# Altium schematic sheet Power.SchDoc
size A
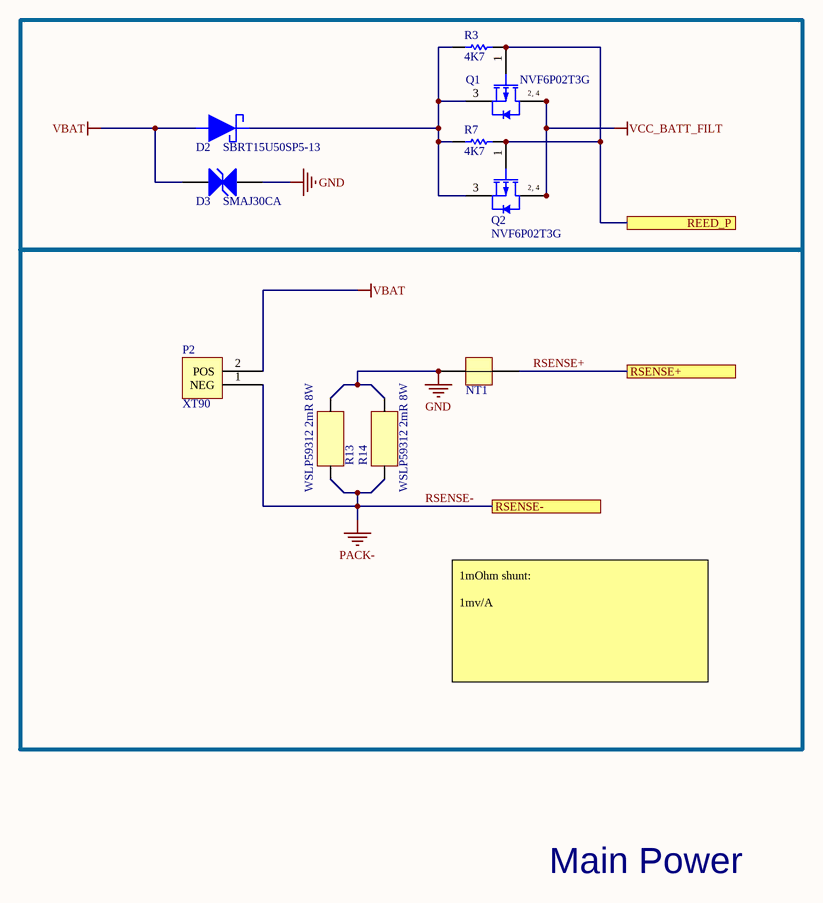
[diagram p0: Power.SchDoc]

## Parts
D2  SBRT15U50SP5-13  [SBRT15U50SP5-13]
D3  SMAJ30CA  [LFUS-DO-214AC-A-2_V]
NT1  Net Tie  [Net_Tie_80mil]  (value not drawn)  (net tie, no BOM)
P2  XT90  [XT90]
Q1  NVF6P02T3G  [ONSC-SOT-223-4-318E-04_V]
Q2  NVF6P02T3G  [ONSC-SOT-223-4-318E-04_V]
R3  4K7  [RESC0603(1608)_L]
R7  4K7  [RESC0603(1608)_L]
R13  WSLP59312 2mR 8W  [WSLP59312L000FEA]
R14  WSLP59312 2mR 8W  [WSLP59312L000FEA]

## Ports
REED_P, RSENSE+, RSENSE-

## Nets
GND: D3.2(A) NT1.1 R13.2 R14.2
RSENSE-: P2.1(NEG) R13.1 R14.1 ; port RSENSE-  [also labelled PACK-]
VBAT: D2.1 D3.1(A) P2.2(POS)
VCC_BATT_FILT: Q1.2(D) Q1.4(D) Q2.2(D) Q2.4(D)
REED_P: Q1.1(G) Q2.1(G) R3.1 R7.1 ; port REED_P
RSENSE+: NT1.2 ; port RSENSE+
NetD2_2: D2.2 Q1.3(S) Q2.3(S) R3.2 R7.2

## Notes on the sheet
- 1mOhm shunt:
  1mv/A
- Main Power
- (in symbol CMP-1058-00713-1) 2, 4

## Library data of the parts
D2 = SBRT15U50SP5-13: Manufacturer: Diodes Incorporated; Diode Type: Super Barrier; Current - Average Rectified (Io): 15A; Speed: Fast Recovery =< 500ns, > 200mA (Io); Supplier 1: Digi-Key; Supplier Part Number 1: SBRT15U50SP5-13DICT-ND; Manufacturer Part Number: SBRT15U50SP5-13; RoHS: RoHS Compliant; Category: Discrete Semiconductor Products; Stock 1: 12134; Pricing 1: 1=0.93, 10=0.823, 100=0.6306, 500=0.49852, 1000=0.39882 (USD); Packaging: Cut Tape (CT); Part Status: Active; Capacitance @ Vr, F: -; Mounting Type: Surface Mount; Package / Case: PowerDI™ 5; Supplier Device Package: PowerDI®5; Operating Temperature - Junction: -65°C ~ 150°C; ComponentLink1URL: https://media.digikey.com/pdf/Data%20Sheets/Diodes%20PDFs/SBRT15U50SP5.pdf; ComponentLink1Description: https://media.digikey.com/pdf/Data%20Sheets/Diodes%20PDFs/SBRT15U50SP5.pdf
D3 = CMP-2000-07088-1: Transient Voltage Suppression Diode, 30 V, -65 to 150 degC, 2-Pin SMD, RoHS, Tape and Reel; Manufacturer: Littelfuse-Inc.; Current - Peak Pulse (10/1000µs): 8.3A; Power - Peak Pulse: 400W; Voltage - Breakdown (Min): 33.3V; Bidirectional Channels: 1; Power Line Protection: No; Voltage - Clamping (Max) @ Ipp: 48.4V; Voltage - Reverse Standoff (Typ): 30V; Type: Zener; Category: CircuitProtection; Datasheet Version: 11/2015; Package Description: 2-Pin Surface Mount Device, Body 4.295 x 2.595 mm; Family: TVS-Diodes; Manufacturer URL: http://www.littelfuse.com/; Series: SMAJ; Package / Case: DO-214AC,SMA; Capacitance @ Frequency: -; Package Reference: DO-214AC; Packaging: Digi-Reel®; Applications: GeneralPurpose; Mounting Technology: SurfaceMount; Mounting Type: SurfaceMount; Unidirectional Channels: -; Supplier Device Package: DO-214AC(SMA); Operating Temperature: -55°C~150°C(TJ); Datasheet URL: http://www.littelfuse.com/~/media/electronics/datasheets/tvs_diodes/littelfuse_tvs_diode_smaj_datasheet.pdf.pdf
NT1 = Net Tie: Use to tie together nets
Q1 Q2 = CMP-1058-00713-1: Power MOSFET, -10 A, -20 V, P-Channel, 4-Pin SOT-223, Pb-Free, Tape and Reel; Manufacturer: On Semiconductor; VGS Max (V): 8; VGS(th) Max (V): 1; Channel Polarity: P Channel; V(BR)DSS Min (V): 20; Configuration: Single; Qrr Typ (nC): 36; PD Max (W): 8.3; Package Type: SOT-223-4 / TO-261-4; ComponentLink3URL: http://www.onsemi.com/pub_link/Collateral/318E-04.PDF; ComponentLink1Description: Manufacturer URL; ComponentLink2URL: http://www.onsemi.com/pub_link/Collateral/NTF6P02T3-D.PDF; Mounting Technology: Surface Mount; PackageVersion: Rev. N, 08/2009; RoHS: Pb-Free; Packing: Tape and Reel; PartNumber: NVF6P02T3G; PackageReference: SOT-223-4-318E-04; ComponentLink1URL: http://www.onsemi.com/; PackageDescription: 4-Pin Small Outline Transistor, Body 6.5 x 3.5 mm, Pitch 2.3 mm; ComponentLink3Description: Package Specification; ComponentLink2Description: Datasheet; DatasheetVersion: Rev. 6
R3 R7 = CMP-1012-00586-1: 4K7 0.1W 1% 0603 (1608 Metric)  SMD; Case-EIA: 0603; Case-Metric: 1608; Value: 4700.00 Ohm; Power: 0.1 W; Tolerance: 1 %; Technology: SMT
R13 R14 = WSLP59312L000FEA